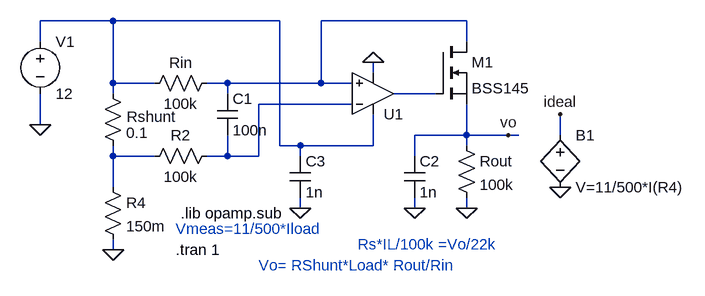
[diagram p0: schematic INAInside.asc]
INAInside.asc, the LTspice schematic file:
Version 4
SHEET 1 1072 760
WIRE 112 368 0 368
WIRE 368 368 112 368
WIRE 656 368 432 368
WIRE 0 400 0 368
WIRE 656 400 656 368
WIRE 512 448 512 432
WIRE 112 464 112 368
WIRE 176 464 112 464
WIRE 288 464 256 464
WIRE 432 464 432 368
WIRE 432 464 288 464
WIRE 480 464 432 464
WIRE 112 480 112 464
WIRE 288 480 288 464
WIRE 608 480 544 480
WIRE 480 496 336 496
WIRE 0 528 0 480
WIRE 656 544 656 496
WIRE 656 544 576 544
WIRE 720 544 656 544
WIRE 736 544 720 544
WIRE 800 544 800 512
WIRE 368 560 368 368
WIRE 400 560 368 560
WIRE 512 560 512 512
WIRE 512 560 400 560
WIRE 656 560 656 544
WIRE 112 576 112 560
WIRE 176 576 112 576
WIRE 288 576 288 544
WIRE 288 576 256 576
WIRE 336 576 336 496
WIRE 336 576 288 576
WIRE 400 576 400 560
WIRE 576 576 576 544
WIRE 112 624 112 576
WIRE 400 656 400 640
WIRE 576 656 576 640
WIRE 656 656 656 640
WIRE 112 720 112 704
FLAG 656 656 0
FLAG 512 432 0
FLAG 112 720 0
FLAG 0 528 0
FLAG 800 624 0
FLAG 800 512 ideal
FLAG 720 544 vo
FLAG 576 656 0
FLAG 400 656 0
SYMBOL res 640 544 R0
SYMATTR InstName Rout
SYMATTR Value 100k
SYMBOL res 272 448 R90
WINDOW 0 0 56 VBottom 2
WINDOW 3 32 56 VTop 2
SYMATTR InstName Rin
SYMATTR Value 100k
SYMBOL res 272 560 R90
WINDOW 0 0 56 VBottom 2
WINDOW 3 32 56 VTop 2
SYMATTR InstName R2
SYMATTR Value 100k
SYMBOL voltage 0 384 R0
SYMATTR InstName V1
SYMATTR Value 12
SYMBOL res 96 464 R0
WINDOW 0 37 52 Left 2
SYMATTR InstName Rshunt
SYMATTR Value 0.1
SYMBOL res 96 608 R0
SYMATTR InstName R4
SYMATTR Value 150m
SYMBOL bv 800 528 R0
SYMATTR InstName B1
SYMATTR Value V=11/500*I(R4)
SYMBOL nmos 608 400 R0
SYMATTR InstName M1
SYMATTR Value BSS145
SYMBOL cap 272 480 R0
SYMATTR InstName C1
SYMATTR Value 100n
SYMBOL cap 560 576 R0
SYMATTR InstName C2
SYMATTR Value 1n
SYMBOL OpAmps\\UniversalOpAmp2 512 480 M180
SYMATTR InstName U1
SYMBOL cap 384 576 R0
SYMATTR InstName C3
SYMATTR Value 1n
TEXT 208 720 Left 2 !.tran 1
TEXT 208 688 Left 2 ;Vmeas=11/500*Iload
TEXT 216 664 Left 2 !.lib opamp.sub
TEXT 488 712 Left 2 ;Rs*IL/100k =Vo/22k
TEXT 336 744 Left 2 ;Vo= RShunt*Load* Rout/Rin

The netlist it stands for:
* INAInside.asc
Rout vo 0 100k
Rin N002 N001 100k
R2 N004 N005 100k
V1 N001 0 12
Rshunt N001 N005 0.1
R4 N005 0 150m
B1 ideal 0 V=11/500*I(R4)
M1 N002 N003 vo vo BSS145
C1 N002 N004 100n
C2 vo 0 1n
XU1 N002 N004 N001 0 N003 level2 Avol=1Meg GBW=10Meg Slew=10Meg Ilimit=25m Rail=0 Vos=0 En=0 Enk=0 In=0 Ink=0 Rin=500Meg  ; pins In+ In- V+ V- OUT
C3 N001 0 1n
.model NMOS NMOS
.model PMOS PMOS
.lib standard.mos
.tran 1
* Vmeas=11/500*Iload
.lib opamp.sub
* Rs*IL/100k =Vo/22k
* Vo= RShunt*Load* Rout/Rin
.lib UniversalOpAmp2.lib
.backanno
.end